# EasyEDA Pro project ProPrj_AGB_2024-12-26.epro

# Schematic Schematic
Board Name: Board1; Create Date: 2024-12-21; Page Name: P1; Project Name: AGB; Schematic Name: Schematic; Update Date: 2024-12-25; Company: EasyEDA.com; Page Size: A4; Version: V1.0
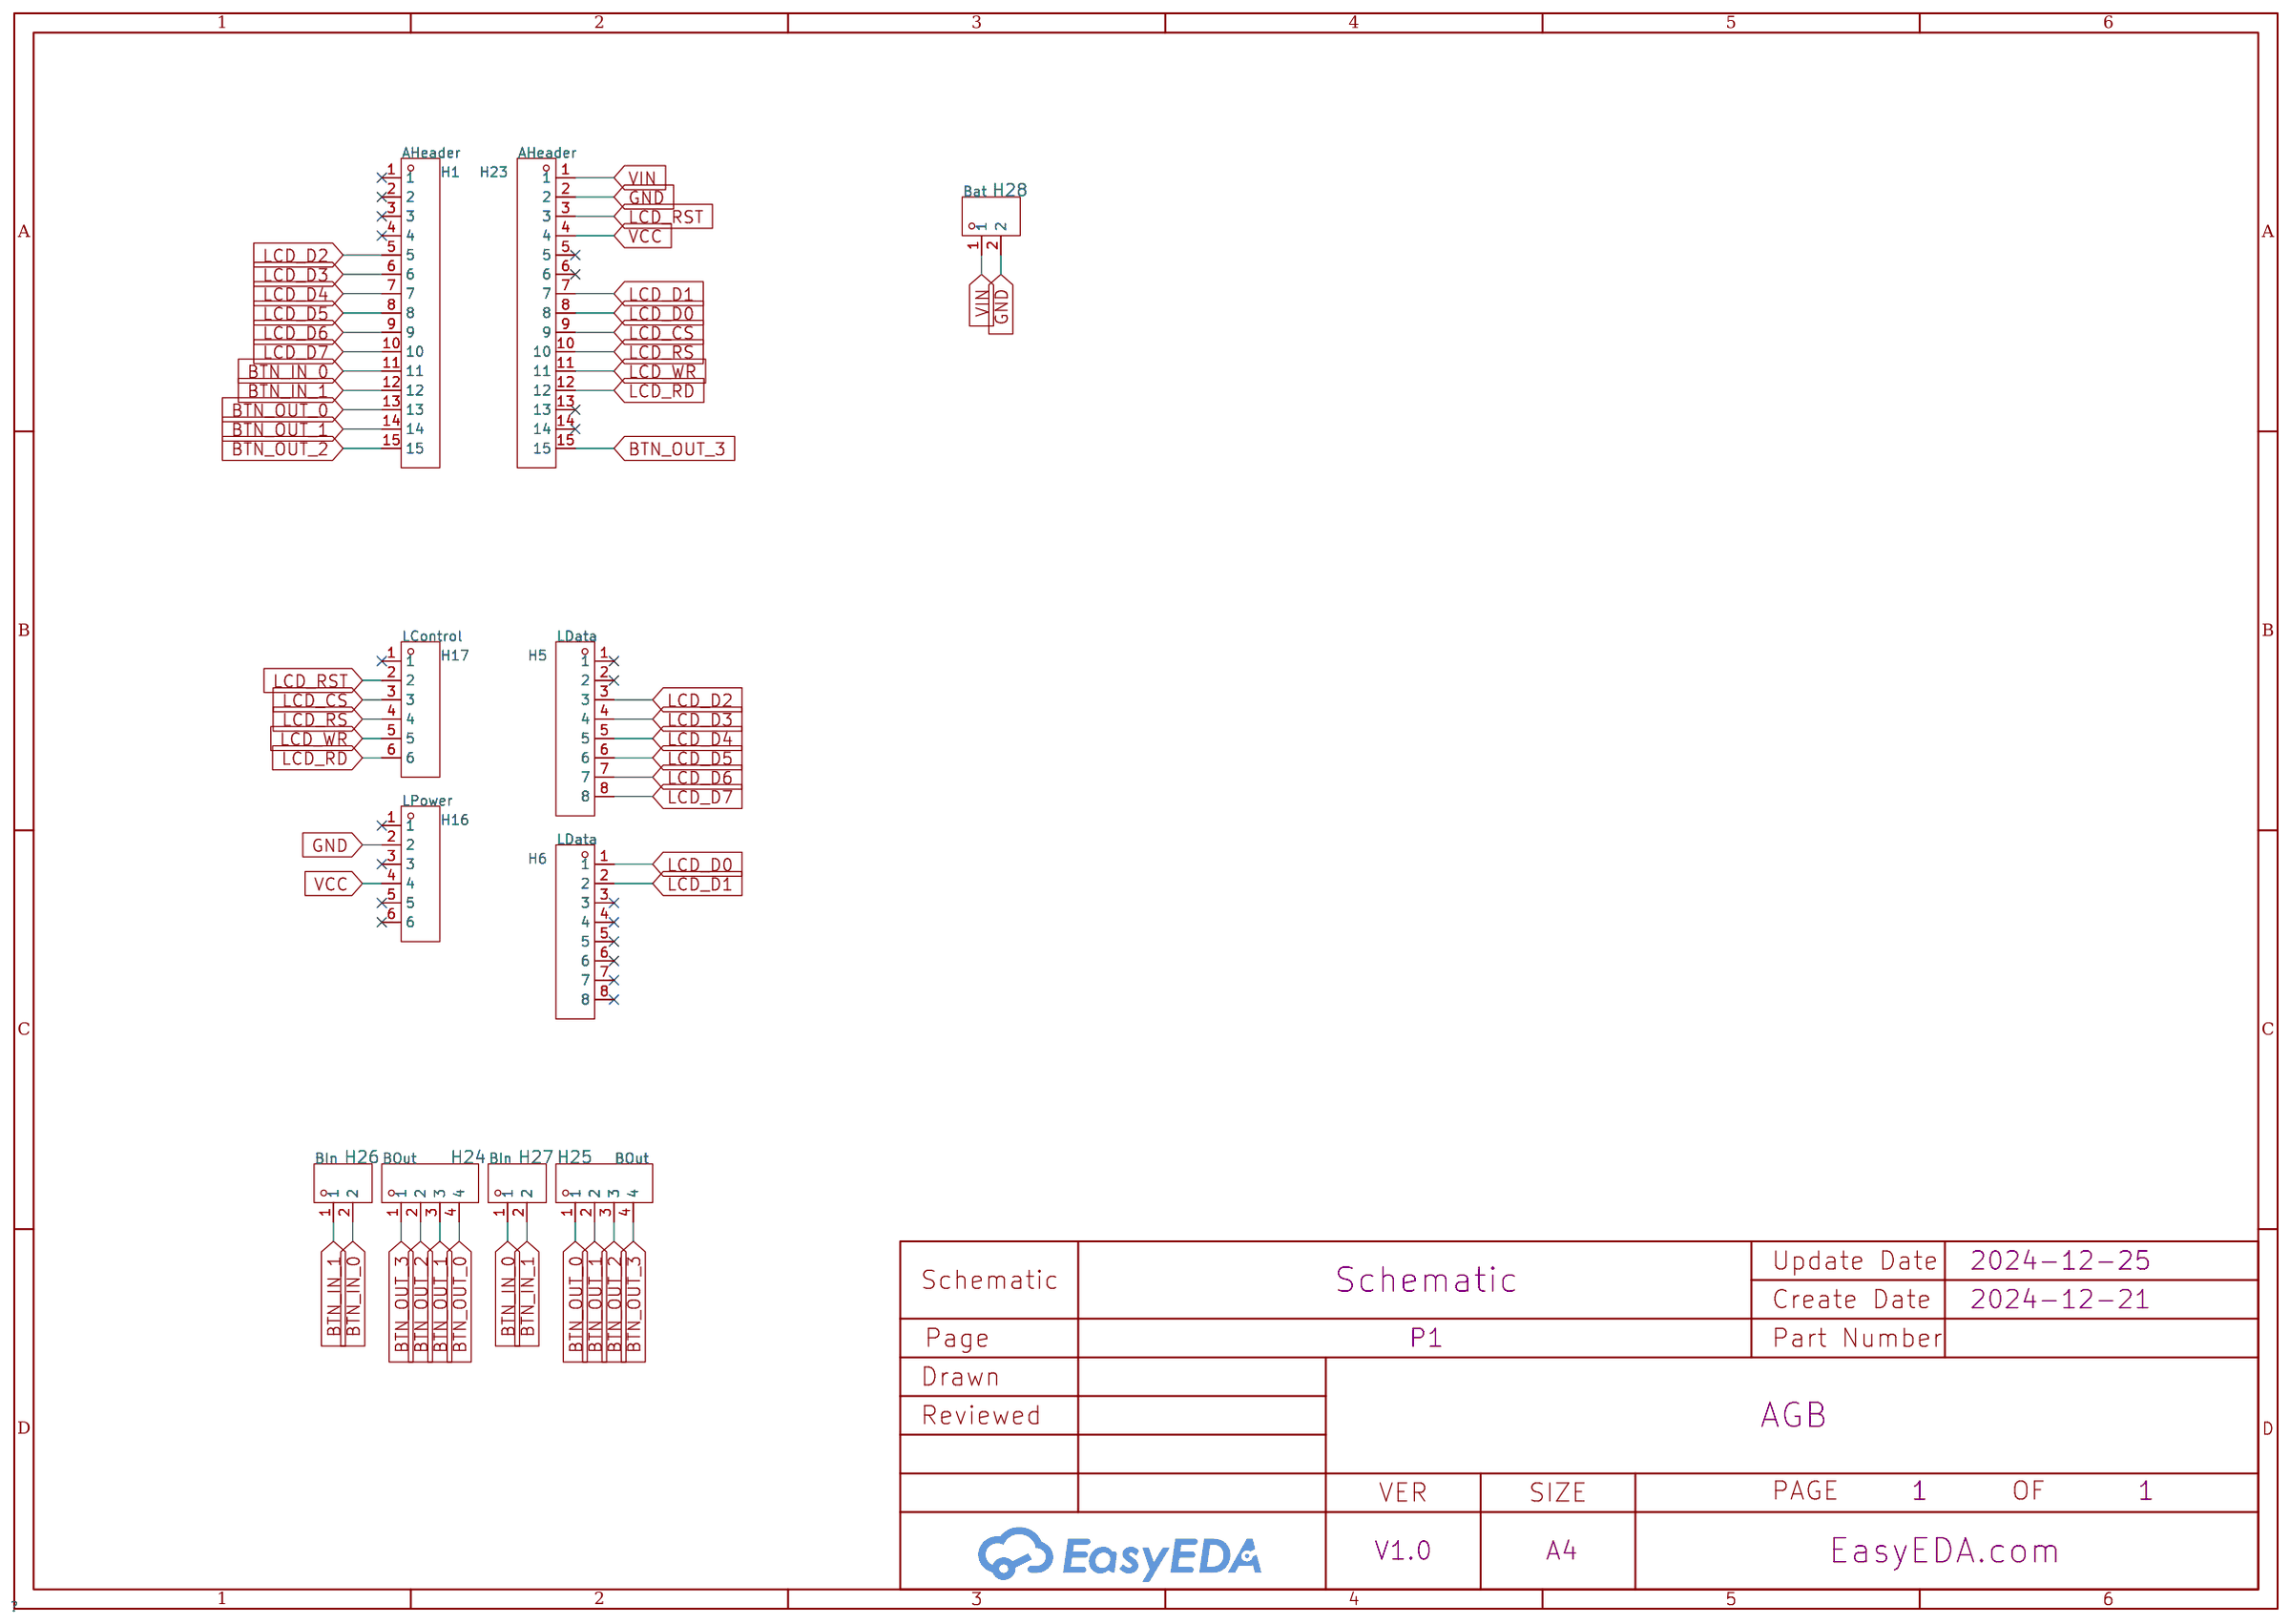
[diagram p0: schematic sheet]

## Parts
H1  AHeader  [HDR-TH_15P-P2.54-V-F]
H5  LData  [HDR-TH_8P-P2.54-V-F]
H6  LData  [HDR-TH_8P-P2.54-V-F]
H16  LPower  [HDR-TH_6P-P2.54-V-F_4]
H17  LControl  [HDR-TH_6P-P2.54-V-F_4]
H23  AHeader  [HDR-TH_15P-P2.54-V-F]
H24  BOut  [HDR-TH_4P-P2.54-H-M-W10.4-N]
H25  BOut  [HDR-TH_4P-P2.54-H-M-W10.4-N]
H26  BIn  [HDR-TH_2P-P2.54-H-M_KH-2.54PH90-1X2P-L13.8]
H27  BIn  [HDR-TH_2P-P2.54-H-M_KH-2.54PH90-1X2P-L13.8]
H28  Bat  [HDR-TH_2P-P2.54-H-M_KH-2.54PH90-1X2P-L13.8]

## Library data of the parts
H1 H23 = PM2.54-1*15: Holes Structure:1x15P Pitch:2.54mm Number of Rows:Plugin Contact Plating:Gold; LCSC Part Name: 1x15P 间距:2.54mm; Supplier Part: C5371989; Manufacturer: ZHOURI(洲日); Supplier Footprint: 插件,P=2.54mm; JLCPCB Part Class: Extended Part; Supplier: LCSC; Holes Structure: 1x15P; Pitch: 2.54mm; Number of Rows: Plugin; Contact Plating: Gold
H5 H6 = PM2.54-1*8: Holes Structure:1x8P Pitch:2.54mm Row Spacing:2.54mm Circular Hole / Square Hole:方孔 Mounting Type:Straight Number of Rows:Plugin Number of Holes:8P Current Rating (Max):2.5A Holes Direction:Top Insulation Height:8.5mm Operating Temperature Range:-40℃~+105; LCSC Part Name: 间距:2.54mm 1x8P 直插; Supplier Part: C5224027; Manufacturer: ZHOURI(洲日); Supplier Footprint: 插件,P=2.54mm; JLCPCB Part Class: Extended Part; Datasheet: https://atta.szlcsc.com/upload/public/pdf/source/20221031/E5BAE727A502DC7C69CE947E807E2296.pdf; Supplier: LCSC; Holes Structure: 1x8P; Pitch: 2.54mm; Row Spacing: 2.54mm; Circular Hole / Square Hole: 方孔; Mounting Type: Straight; Number of Rows: Plugin; Number of Holes: 8P; Current Rating (Max): 2.5A; Holes Direction: Top; Insulation Height: 8.5mm; Operating Temperature Range: -40℃~+105℃
H16 H17 = PM2.54-1*6: Holes Structure:1x6P Pitch:2.54mm Row Spacing:2.54mm Circular Hole / Square Hole:方孔 Mounting Type:Straight Number of Rows:Plugin Number of Holes:6P Current Rating (Max):2.5A Holes Direction:Top Insulation Height:8.5mm Operating Temperature Range:-40℃~+105; LCSC Part Name: 间距:2.54mm 1x6P 直插; Supplier Part: C5224026; Manufacturer: ZHOURI(洲日); Supplier Footprint: 插件,P=2.54mm; JLCPCB Part Class: Extended Part; Datasheet: https://atta.szlcsc.com/upload/public/pdf/source/20221031/E093F9F6C4E58F4CC51055FE981DF342.pdf; Supplier: LCSC; Holes Structure: 1x6P; Pitch: 2.54mm; Row Spacing: 2.54mm; Circular Hole / Square Hole: 方孔; Mounting Type: Straight; Number of Rows: Plugin; Number of Holes: 6P; Current Rating (Max): 2.5A; Holes Direction: Top; Insulation Height: 8.5mm; Operating Temperature Range: -40℃~+105℃
H24 H25 = KH-2.54PH90-1X4P-L13.8: Pin Structure:1x4P Pitch:2.54mm Row Spacing:- Circluar Pins/Square Pins:Square Pins Mounting Type:Right-Angle Number of Rows:Plugin Number of Pins:4P Current Rating (Max):3A Voltage Rating (Max):- Length of Mating Pin:6mm Insulation Height:2.5mm Length of; LCSC Part Name: 间距:2.54mm 1x4P 弯插 方针; Supplier Part: C2905425; Manufacturer: kinghelm(金航标); Supplier Footprint: 弯插,P=2.54mm; Datasheet: https://atta.szlcsc.com/upload/public/pdf/source/20211019/634C052142A5F68007D538D46E242F0C.pdf; Supplier: LCSC; Pin Structure: 1x4P; Pitch: 2.54mm; Circluar Pins/Square Pins: Square Pins; Mounting Type: Right-Angle; Number of Rows: Plugin; Number of Pins: 4P; Current Rating (Max): 3A; Length of Mating Pin: 6mm; Insulation Height: 2.5mm; Operating Temperature Range: -40℃~+105℃; Color: Black
H26-H28 = KH-2.54PH90-1X2P-L13.8: Pin Structure:1x2P Pitch:2.54mm Row Spacing:- Circluar Pins/Square Pins:Square Pins Mounting Type:Right-Angle Number of Rows:Plugin Number of Pins:2P Current Rating (Max):3A Voltage Rating (Max):- Length of Mating Pin:6mm Insulation Height:2.5mm Length of; LCSC Part Name: 间距:2.54mm 1x2P 弯插 方针; Supplier Part: C2905424; Manufacturer: kinghelm(金航标); Supplier Footprint: 弯插,P=2.54mm; JLCPCB Part Class: Extended Part; Datasheet: https://atta.szlcsc.com/upload/public/pdf/source/20211019/C2A26F66DF7B2313775FA5923470F65B.pdf; Supplier: LCSC; Pin Structure: 1x2P; Pitch: 2.54mm; Circluar Pins/Square Pins: Square Pins; Mounting Type: Right-Angle; Number of Rows: Plugin; Number of Pins: 2P; Current Rating (Max): 3A; Length of Mating Pin: 6mm; Insulation Height: 2.5mm; Operating Temperature Range: -40℃~+105℃; Color: Black

## Nets
GND: H16.2 H23.2 H28.2
VCC: H16.4 H23.4
VIN: H23.1 H28.1
BTN_IN_0: H1.11 H26.2 H27.1
BTN_IN_1: H1.12 H26.1 H27.2
BTN_OUT_0: H1.13 H24.4 H25.1
BTN_OUT_1: H1.14 H24.3 H25.2
BTN_OUT_2: H1.15 H24.2 H25.3
BTN_OUT_3: H23.15 H24.1 H25.4
LCD_CS: H17.3 H23.9
LCD_D0: H6.1 H23.8
LCD_D1: H6.2 H23.7
LCD_D2: H1.5 H5.3
LCD_D3: H1.6 H5.4
LCD_D4: H1.7 H5.5
LCD_D5: H1.8 H5.6
LCD_D6: H1.9 H5.7
LCD_D7: H1.10 H5.8
LCD_RD: H17.6 H23.12
LCD_RS: H17.4 H23.10
LCD_RST: H17.2 H23.3
LCD_WR: H17.5 H23.11

Not connected (* = marked no-connect by the designer): H1 1* 2* 3* 4*; H5 1* 2*; H6 3* 4* 5* 6* 7* 8*; H16 1* 3* 5* 6*; H17 1*; H23 5* 6* 13* 14*

# Board PCB_1
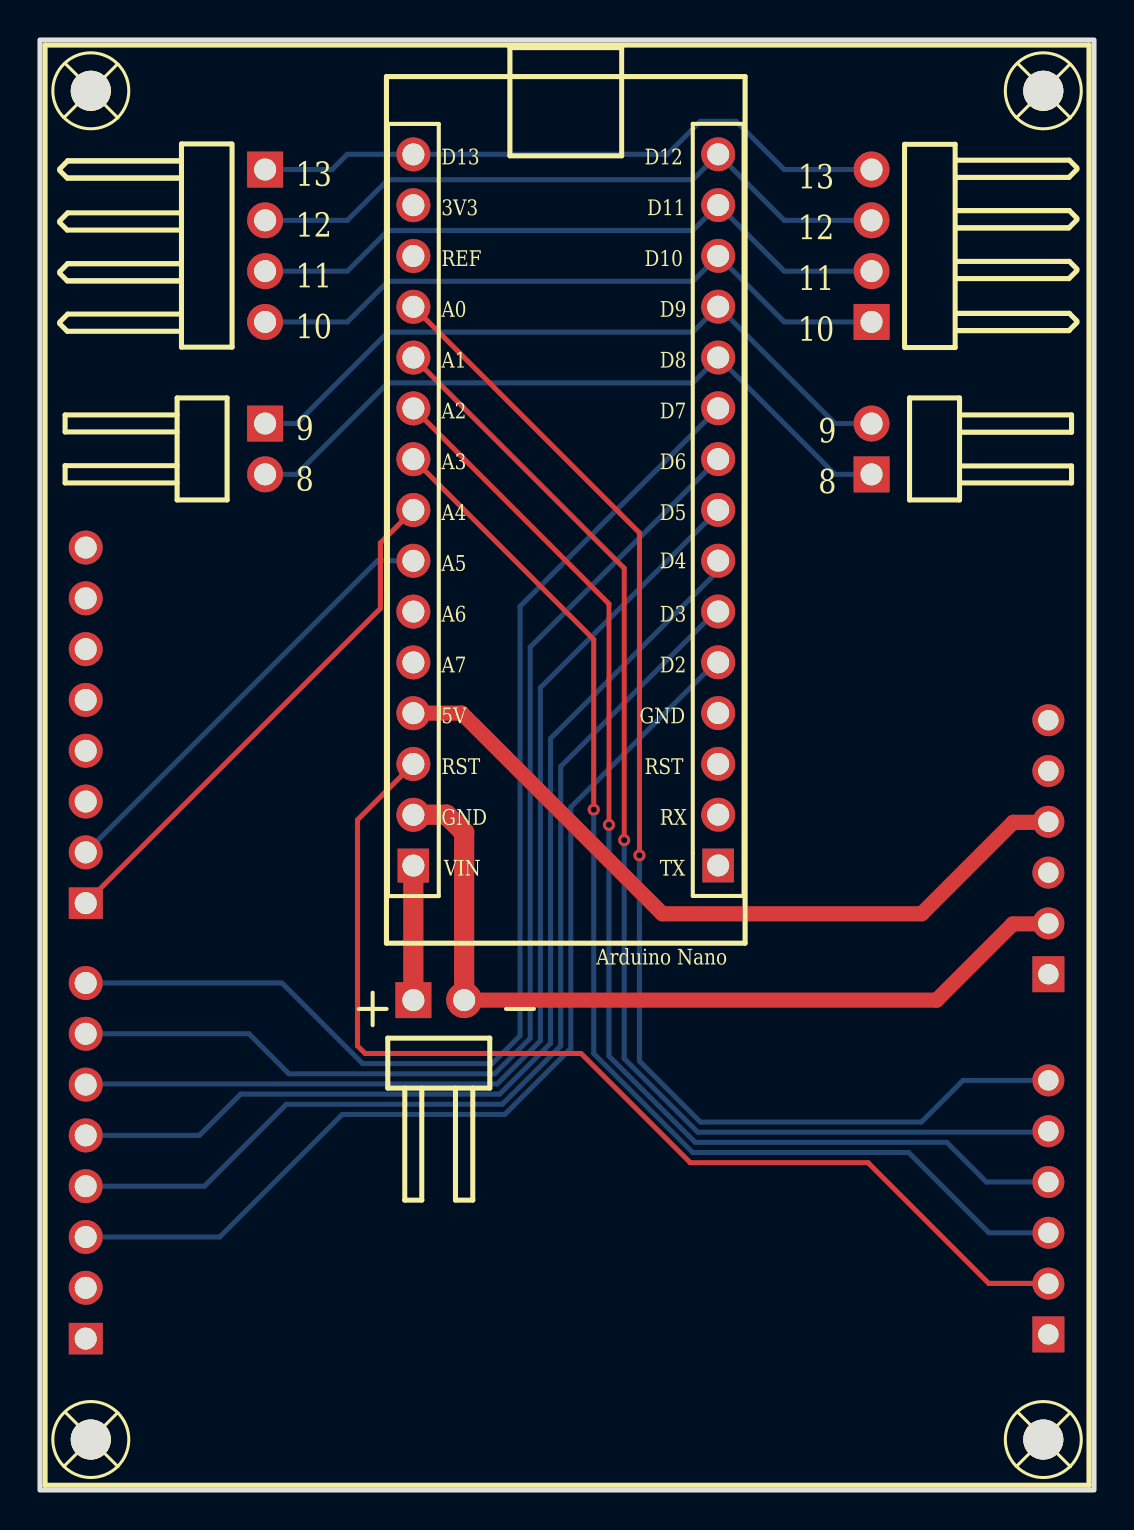
[diagram p1: board, top side]
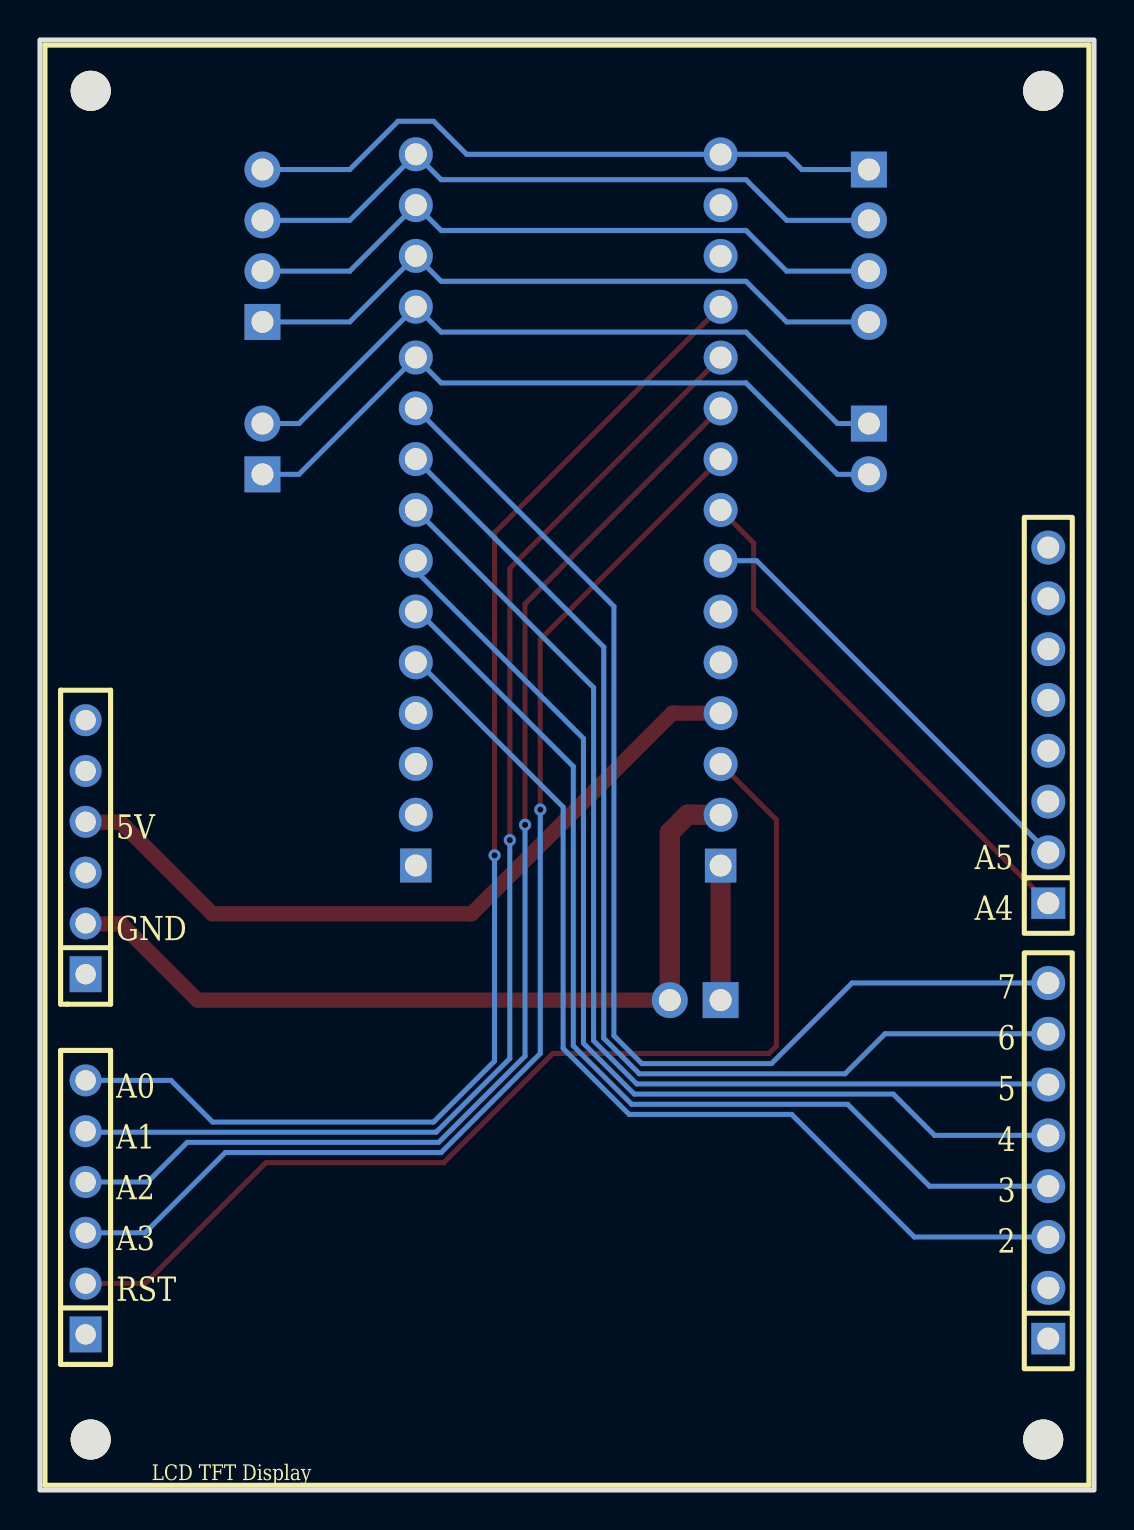
[diagram p2: board, bottom side, seen from below]

Outline 52.7 x 72.5 mm; copper layers: Top Layer, Bottom Layer. Coordinates in mm from the lower left corner of the outline.
Outline path: rectangle 0,72.5 52.7,0
Stack: Top Layer 0.035mm / Dielectric1 1.51mm FR4 er 4.5 / Bottom Layer 0.035mm

## Design rules (mm)
template: JLCPCB Capability(Two Layers Board)
spacing copperThickness1oz (default): track to track 0.102, other pairs 0.152 to 0.3
spacing copperThickness2oz: track to track 0.203, other pairs 0.152 to 0.3
track width copperThickness1oz (default): min 0.127, default 0.254, max 2.54
track width copperThickness2oz: min 0.203, default 0.254, max 2.54
differential pair differentialPair (default): width min 0.127, default 0.254, max 2.54; gap min 0.152, default 0.152
via viaSize (default): diameter min 0.5, default 0.61, max 10; hole min 0.3, default 0.305, max 6.3

## Placement (name value [footprint] x y rotation side)
H1  AHeader  [HDR-TH_15P-P2.54-V-F]  33.91 49.01 90 top
H5  LData  [HDR-TH_8P-P2.54-V-F]  2.29 16.46 90 bottom
H6  LData  [HDR-TH_8P-P2.54-V-F]  2.29 38.23 90 bottom
H16  LPower  [HDR-TH_6P-P2.54-V-F_4]  50.42 32.14 90 bottom
H17  LControl  [HDR-TH_6P-P2.54-V-F_4]  50.42 14.13 90 bottom
H23  AHeader  [HDR-TH_15P-P2.54-V-F]  18.67 49 90 top
H24  BOut  [HDR-TH_4P-P2.54-H-M-W10.4-N]  11.26 62.21 270 top
H25  BOut  [HDR-TH_4P-P2.54-H-M-W10.4-N]  41.58 62.21 90 top
H26  BIn  [HDR-TH_2P-P2.54-H-M_KH-2.54PH90-1X2P-L13.8]  11.26 52.05 270 top
H27  BIn  [HDR-TH_2P-P2.54-H-M_KH-2.54PH90-1X2P-L13.8]  41.58 52.05 90 top
H28  Bat  [HDR-TH_2P-P2.54-H-M_KH-2.54PH90-1X2P-L13.8]  19.94 24.49 0 top
SCREW1  -  [Screw-Hole-M2]  2.54 69.96 0 top
SCREW2  -  [Screw-Hole-M2]  50.17 69.96 0 top
SCREW3  -  [Screw-Hole-M2]  2.54 2.52 0 top
SCREW4  -  [Screw-Hole-M2]  50.17 2.52 0 top

## Footprints (pads in the part's own frame, mm; a bottom-side part is the same pattern mirrored in y, then rotated)
HDR-TH_2P-P2.54-H-M_KH-2.54PH90-1X2P-L13.8
  rect 1.8x1.8 hole 1.1: 1(-1.27,0)
  round 1.8 hole 1.1: 2(1.27,0)
HDR-TH_4P-P2.54-H-M-W10.4-N
  rect 1.8x1.8 hole 1.1: 1(-3.81,0)
  round 1.8 hole 1.1: 2(-1.27,0) 3(1.27,0) 4(3.81,0)
HDR-TH_6P-P2.54-V-F_4
  rect 1.8x1.6 hole 1.02: 1(-6.35,0)
  round 1.6 hole 1.02: 2(-3.81,0) 3(-1.27,0) 4(1.27,0) 5(3.81,0) 6(6.35,0)
HDR-TH_8P-P2.54-V-F
  rect 1.575x1.7 hole 1.1: 1(-8.89,0)
  round 1.7 hole 1.1: 2(-6.35,0) 3(-3.81,0) 4(-1.27,0) 5(1.27,0) 6(3.81,0) 7(6.35,0) 8(8.89,0)
HDR-TH_15P-P2.54-V-F
  rect 1.7x1.575 hole 1.1: 1(-17.78,0)
  round 1.7 hole 1.1: 2(-15.24,0) 3(-12.7,0) 4(-10.16,0) 5(-7.62,0) 6(-5.08,0) 7(-2.54,0) 8(0,0) 9(2.54,0) 10(5.08,0) 11(7.62,0) 12(10.16,0) 13(12.7,0) 14(15.24,0) 15(17.78,0)
Screw-Hole-M2
  round 2 hole 2: 1(0,0)

## Nets
As in the schematic.

Pads without a net: H1 1 2 3 4; H5 1 2; H6 3 4 5 6 7 8; H16 1 3 5 6; H17 1; H23 5 6 13 14; SCREW1 1; SCREW2 1; SCREW3 1; SCREW4 1

## Via types
v1: diameter 0.61, hole 0.305, Top Layer to Bottom Layer, 4 vias

## Routing (per net, layer and track width the routed paths; a pad name or vN(x,y) marks a point on that pad's centre or on a via; arc(x,y) is an arc through that point)
GND: length 42.1
  Top Layer w0.762: 50.42,28.3 48.64,28.3 44.83,24.49 H28.2
  Top Layer w1.016: H28.2 21.21,32.88 20.32,33.77 18.67,33.77
VCC: length 37.8
  Top Layer w0.762: 50.42,33.38 48.66,33.38 44.09,28.81 31.11,28.81 21.08,38.85 18.67,38.85
VIN: length 6.7
  Top Layer w1.016: 18.67,31.23 H28.1
BTN_IN_0: length 35.2
  Bottom Layer w0.254: H27.1 39.75,50.78 H1.11 32.64,55.36 17.4,55.36 12.83,50.78 H26.2
BTN_IN_1: length 35.2
  Bottom Layer w0.254: H27.2 39.75,53.32 H1.12 32.64,57.9 17.4,57.9 12.83,53.32 H26.1
BTN_OUT_0: length 33.1
  Bottom Layer w0.254: H24.4 15.37,58.4 17.4,60.44 32.64,60.44 H1.13 37.21,58.4 H25.1
BTN_OUT_1: length 33.1
  Bottom Layer w0.254: H25.2 37.21,60.94 H1.14 32.64,62.98 17.4,62.98 15.37,60.94 H24.3
BTN_OUT_2: length 33.1
  Bottom Layer w0.254: H25.3 37.21,63.48 H1.15 32.64,65.52 17.4,65.52 15.37,63.48 H24.2
BTN_OUT_3: length 32.3
  Bottom Layer w0.254: H24.1 14.61,66.02 15.37,66.79 31.37,66.79 33.02,68.44 34.8,68.44 37.21,66.02 H25.4
LCD_CS: length 59.9
  Top Layer w0.254: 18.67,51.55 27.69,42.53 v1(27.69,34.02)
  Bottom Layer w0.254: H17.3 47.45,12.86 43.43,16.87 32.64,16.87 27.69,21.83 v1(27.69,34.02)
LCD_D0: length 26.4
  Top Layer w0.254: H6.1 17.02,44.07 17.02,47.35 18.67,49.01
LCD_D1: length 22.4
  Bottom Layer w0.254: H6.2 16.87,46.47 18.67,46.47
LCD_D2: length 50.6
  Bottom Layer w0.254: H5.3 8.98,12.65 15.11,18.78 23.24,18.78 26.54,22.08 26.54,34.15 33.78,41.39 H1.5
LCD_D3: length 51.7
  Bottom Layer w0.254: H5.4 8.22,15.19 12.32,19.29 23.11,19.29 26.04,22.21 26.04,36.18 33.78,43.93 H1.6
LCD_D4: length 52.7
  Bottom Layer w0.254: H5.5 7.97,17.73 10.03,19.8 22.99,19.8 25.53,22.34 25.53,37.58 33.91,45.96 H1.7
LCD_D5: length 53.9
  Bottom Layer w0.254: H5.6 2.32,20.3 22.86,20.3 25.02,22.46 25.02,40.12 H1.8
LCD_D6: length 56.6
  Bottom Layer w0.254: H1.9 24.51,42.15 24.51,22.59 22.73,20.81 12.45,20.81 10.45,22.81 H5.7
LCD_D7: length 59.4
  Bottom Layer w0.254: H5.8 12.1,25.35 16.13,21.32 22.61,21.32 24,22.72 24,44.18 H1.10
LCD_RD: length 65
  Top Layer w0.254: v1(29.97,31.73) 29.97,47.86 18.67,59.17
  Bottom Layer w0.254: H17.6 46.15,20.48 44.07,18.4 33.02,18.4 29.97,21.45 v1(29.97,31.73)
LCD_RS: length 61
  Top Layer w0.254: 18.67,54.09 28.45,44.31 v1(28.45,33.26)
  Bottom Layer w0.254: H17.4 47.32,15.4 45.34,17.38 32.76,17.38 28.45,21.7 v1(28.45,33.26)
LCD_RST: length 54.7
  Top Layer w0.254: 18.67,36.31 15.88,33.51 15.88,22.21 16.26,21.83 27.05,21.83 32.51,16.37 41.4,16.37 47.44,10.33 50.05,10.33 50.06,10.32 H17.2
LCD_WR: length 62.2
  Top Layer w0.254: v1(29.21,32.5) 29.21,46.08 18.67,56.63
  Bottom Layer w0.254: H17.5 50.37,17.89 32.89,17.89 29.21,21.57 v1(29.21,32.5)

## Text on the board
Bottom Silkscreen Layer: LCD TFT Display | 7 | 6 | 5 | 4 | 3 | 2 | A5 | A4 | 5V | GND | A0 | A1 | A2 | A3 | RST
Top Silkscreen Layer: + | - | D13 | 3V3 | REF | A0 | A1 | A2 | A3 | A4 | A5 | A6 | A7 | 5V | RST | GND | VIN | Arduino Nano | D12 | D10 | D11 | D9 | D8 | D7 | D6 | D5 | D4 | D3 | D2 | RX | TX | 13 | 12 | 11 | 10 | 9 | 8
